# Altium schematic sheet Rpi_GPIO.SchDoc
size A4
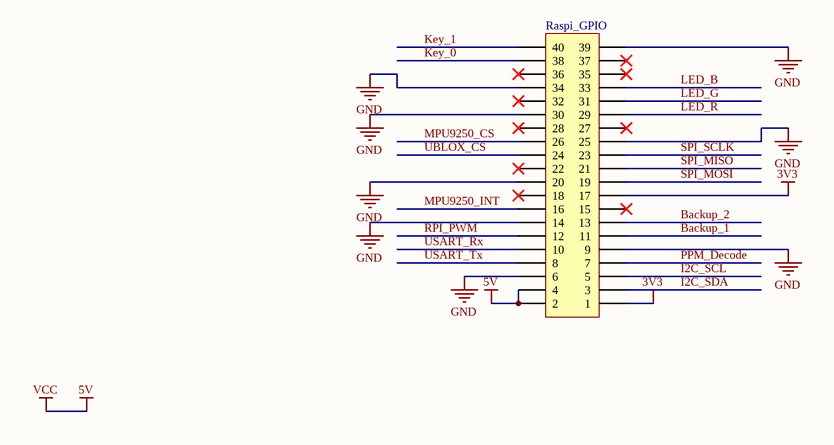
[diagram p0: Rpi_GPIO.SchDoc]

## Parts
Raspi_GPIO  Header 20X2  [HDR2X20]  (value not drawn)

## Nets
3V3: Raspi_GPIO.1 Raspi_GPIO.17
5V: Raspi_GPIO.2 Raspi_GPIO.4  [also labelled VCC]
GND: Raspi_GPIO.6 Raspi_GPIO.9 Raspi_GPIO.14 Raspi_GPIO.20 Raspi_GPIO.25 Raspi_GPIO.30 Raspi_GPIO.34 Raspi_GPIO.39
Backup_1: Raspi_GPIO.11
Backup_2: Raspi_GPIO.13
I2C_SCL: Raspi_GPIO.5
I2C_SDA: Raspi_GPIO.3
Key_0: Raspi_GPIO.38
Key_1: Raspi_GPIO.40
LED_B: Raspi_GPIO.33
LED_G: Raspi_GPIO.31
LED_R: Raspi_GPIO.29
MPU9250_CS: Raspi_GPIO.26
MPU9250_INT: Raspi_GPIO.16
PPM_Decode: Raspi_GPIO.7
RPI_PWM: Raspi_GPIO.12
SPI_MISO: Raspi_GPIO.21
SPI_MOSI: Raspi_GPIO.19
SPI_SCLK: Raspi_GPIO.23
UBLOX_CS: Raspi_GPIO.24
USART_Rx: Raspi_GPIO.10
USART_Tx: Raspi_GPIO.8

Not connected (* = marked no-connect by the designer): Raspi_GPIO 15* 18* 22* 27* 28* 32* 35* 36* 37*

## Library data of the parts
Raspi_GPIO = Header 20X2: Header, 20-Pin, Dual row; LatestRevisionDate: 17-Jul-2002; LatestRevisionNote: Re-released for DXP Platform.; Publisher: Altium Limited